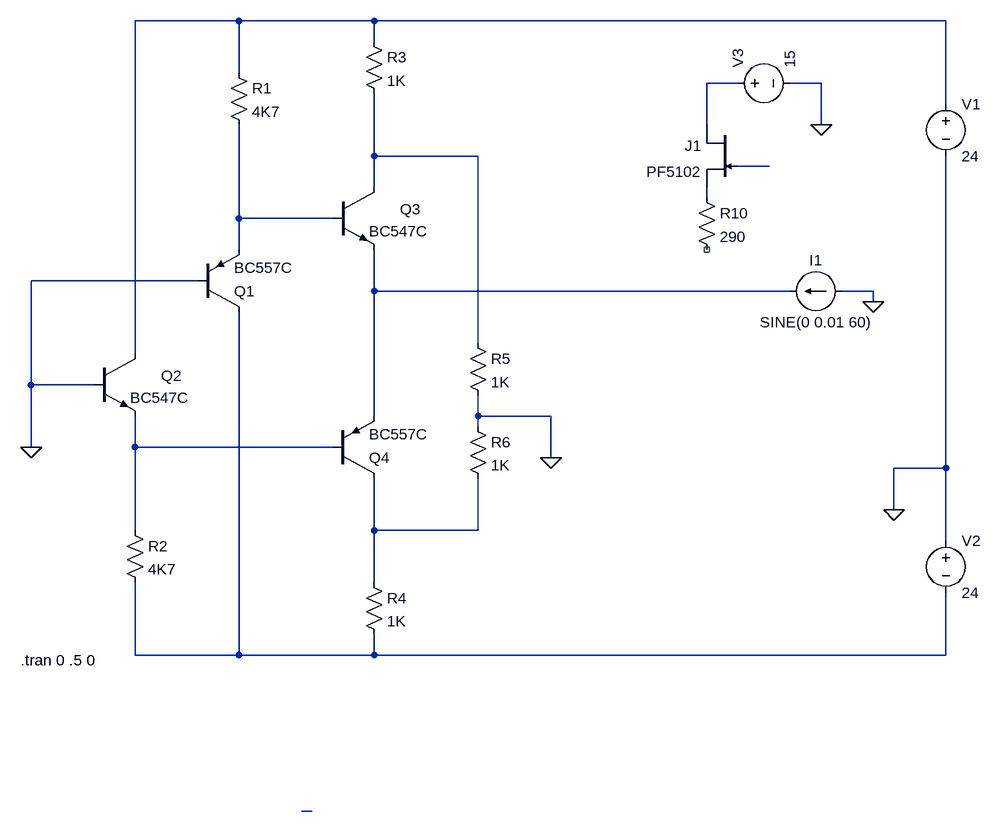
[diagram p0: schematic JFETIV.asc]
JFETIV.asc, the LTspice schematic file:
Version 4
SHEET 1 2092 1188
WIRE 352 -368 192 -368
WIRE 560 -368 352 -368
WIRE 1440 -368 560 -368
WIRE 560 -336 560 -368
WIRE 352 -288 352 -368
WIRE 1120 -272 1072 -272
WIRE 1248 -272 1200 -272
WIRE 1440 -240 1440 -368
WIRE 1072 -208 1072 -272
WIRE 1248 -208 1248 -272
WIRE 560 -160 560 -256
WIRE 720 -160 560 -160
WIRE 1168 -144 1120 -144
WIRE 560 -112 560 -160
WIRE 1072 -96 1072 -112
WIRE 352 -64 352 -208
WIRE 496 -64 352 -64
WIRE 352 -16 352 -64
WIRE 288 32 32 32
WIRE 560 48 560 -16
WIRE 1200 48 560 48
WIRE 1328 48 1280 48
WIRE 1328 64 1328 48
WIRE 720 128 720 -160
WIRE 192 144 192 -368
WIRE 32 192 32 32
WIRE 128 192 32 192
WIRE 560 240 560 48
WIRE 720 240 720 208
WIRE 832 240 720 240
WIRE 720 256 720 240
WIRE 32 288 32 192
WIRE 192 288 192 240
WIRE 496 288 192 288
WIRE 832 304 832 240
WIRE 1440 320 1440 -160
WIRE 1440 320 1360 320
WIRE 1360 384 1360 320
WIRE 192 416 192 288
WIRE 560 416 560 336
WIRE 720 416 720 336
WIRE 720 416 560 416
WIRE 1440 432 1440 320
WIRE 560 496 560 416
WIRE 192 608 192 496
WIRE 352 608 352 80
WIRE 352 608 192 608
WIRE 560 608 560 576
WIRE 560 608 352 608
WIRE 1440 608 1440 512
WIRE 1440 608 560 608
WIRE 464 848 448 848
FLAG 32 288 0
FLAG 1360 384 0
FLAG 1248 -208 0
FLAG 1328 64 0
FLAG 832 304 0
SYMBOL pnp 288 80 M180
SYMATTR InstName Q1
SYMATTR Value BC557C
SYMBOL npn 128 144 R0
WINDOW 0 104 34 Left 2
SYMATTR InstName Q2
SYMATTR Value BC547C
SYMBOL res 336 -304 R0
SYMATTR InstName R1
SYMATTR Value 4K7
SYMBOL res 176 400 R0
SYMATTR InstName R2
SYMATTR Value 4K7
SYMBOL npn 496 -112 R0
WINDOW 0 104 34 Left 2
SYMATTR InstName Q3
SYMATTR Value BC547C
SYMBOL pnp 496 336 M180
SYMATTR InstName Q4
SYMATTR Value BC557C
SYMBOL res 544 -352 R0
SYMATTR InstName R3
SYMATTR Value 1K
SYMBOL res 544 480 R0
SYMATTR InstName R4
SYMATTR Value 1K
SYMBOL voltage 1440 -256 R0
WINDOW 123 0 0 Left 2
WINDOW 39 0 0 Left 2
SYMATTR InstName V1
SYMATTR Value 24
SYMBOL voltage 1440 416 R0
WINDOW 123 0 0 Left 2
WINDOW 39 0 0 Left 2
SYMATTR InstName V2
SYMATTR Value 24
SYMBOL njf 1120 -208 M0
SYMATTR InstName J1
SYMATTR Value PF5102
SYMBOL res 1056 -112 R0
SYMATTR InstName R10
SYMATTR Value 290
SYMBOL voltage 1104 -272 R270
WINDOW 123 0 0 Left 2
WINDOW 39 0 0 Left 2
SYMATTR InstName V3
SYMATTR Value 15
SYMBOL current 1280 48 R90
WINDOW 0 -32 40 VBottom 2
WINDOW 3 32 40 VTop 2
WINDOW 123 0 0 Left 2
WINDOW 39 0 0 Left 2
SYMATTR InstName I1
SYMATTR Value SINE(0 0.01 60)
SYMBOL res 704 112 R0
SYMATTR InstName R5
SYMATTR Value 1K
SYMBOL res 704 240 R0
SYMATTR InstName R6
SYMATTR Value 1K
TEXT 16 616 Left 2 !.tran 0 .5 0

The netlist it stands for:
* JFETIV.asc
Q1 N010 0 N006 0 BC557C
Q2 N001 0 N008 0 BC547C
R1 N001 N006 4K7
R2 N008 N010 4K7
Q3 N003 N006 N007 0 BC547C
Q4 N009 N008 N007 0 BC557C
R3 N001 N003 1K
R4 N009 N010 1K
V1 N001 0 24
V2 0 N010 24
J1 N002 N004 N005 PF5102
R10 N005 NC_01 290
V3 N002 0 15
I1 0 N007 SINE(0 0.01 60)
R5 N003 0 1K
R6 0 N009 1K
.model NPN NPN
.model PNP PNP
.lib standard.bjt
.model NJF NJF
.model PJF PJF
.lib standard.jft
.tran 0 .5 0
.backanno
.end